# EAGLE design sc_v1 (EAGLE 9.6.2)
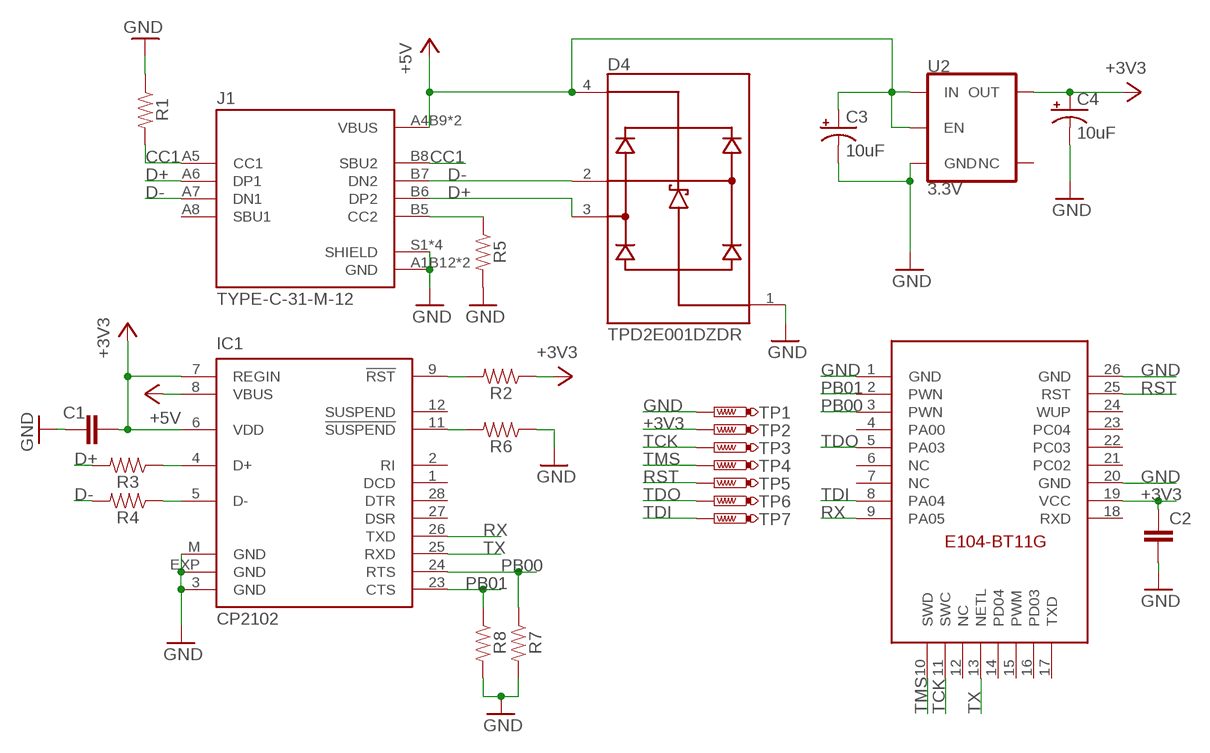
[diagram p0: schematic, sheet 1]

## Parts
C1  100nf  CAP0402  [CAPC1005X40N]
C2  100n  CAP0402  [CAPC1005X40N]
C3  10uF  10UF-POLAR-0603-6.3V-20%(TANT)  [0603-POLAR]
C4  10uF  10UF-POLAR-0603-6.3V-20%(TANT)  [0603-POLAR]
D4  TPD2E001DZDR  [SOT192P237X122-4N]
IC1  CP2102  [MLP28]
J1  TYPE-C-31-M-12  [HRO_TYPE-C-31-M-12]
R1  5.1k  RESISTOR0402  [0402]
R2  4.7k  RESISTOR0402  [0402]
R3  30Ohm  RESISTOR0402  [0402]
R4  30Ohm  RESISTOR0402  [0402]
R5  5.1k  RESISTOR0402  [0402]
R6  10k  RESISTOR0402  [0402]
R7  10k  RESISTOR0402  [0402]
R8  10k  RESISTOR0402  [0402]
TP1  PTR1TP10R  [TP10R]
TP2  PTR1TP10R  [TP10R]
TP3  PTR1TP10R  [TP10R]
TP4  PTR1TP10R  [TP10R]
TP5  PTR1TP10R  [TP10R]
TP6  PTR1TP10R  [TP10R]
TP7  PTR1TP10R  [TP10R]
U2  3.3V  V_REG_AP2112K-3.3V  [SOT23-5]
U$1  E104-BT11G-PCBPCB  [E104-BT11G-PCB]

## Nets
+3V3: C1.2 C2.1 C4.+ IC1.6(VDD) IC1.7(REGIN) R2.1 TP2.TP U2.5(OUT) U$1.19(VCC)
+5V: C3.+ D4.4(VCC) IC1.8(VBUS) J1.A4B9(VBUS) J1.B4A9(VBUS) U2.1(IN) U2.3(EN)
CC1: J1.A5(CC1) J1.B8(SBU2) R1.2
D+: D4.3(IO2) J1.A6(DP1) J1.B6(DP2) R3.2
D-: D4.2(IO1) J1.A7(DN1) J1.B7(DN2) R4.2
GND: C1.1 C2.2 C3.- C4.- D4.1(GND) IC1.3(GND) IC1.EXP(GND) IC1.M(GND) J1.A1B12(GND) J1.B1A12(GND) J1.S1(SHIELD) J1.S2(SHIELD) J1.S3(SHIELD) J1.S4(SHIELD) R1.1 R5.2 R6.1 R7.2 R8.2 TP1.TP U2.2(GND) U$1.1(GND) U$1.20(GND) U$1.26(GND)
N$1: IC1.4(D+) R3.1
N$2: IC1.5(D-) R4.1
N$3: IC1.9(!RST) R2.2
N$4: J1.B5(CC2) R5.1
N$5: IC1.11(!SUSPEND) R6.2
PB00: IC1.24(RTS) R7.1 U$1.3(PWN)
PB01: IC1.23(CTS) R8.1 U$1.2(PWN)
RST: TP5.TP U$1.25(RST)
RX: IC1.26(TXD) U$1.9(PA05)
TCK: TP3.TP U$1.11(SWC)
TDI: TP7.TP U$1.8(PA04)
TDO: TP6.TP U$1.5(PA03)
TMS: TP4.TP U$1.10(SWD)
TX: IC1.25(RXD) U$1.13(NETL)
Unconnected: IC1.1(DCD) IC1.2(RI) IC1.12(SUSPEND) IC1.27(DSR) IC1.28(DTR) J1.A8(SBU1) U2.4(NC) U$1.4(PA00) U$1.6(NC) U$1.7(NC) U$1.12(NC) U$1.14(PD04) U$1.15(PWM) U$1.16(PD03) U$1.17(TXD) U$1.18(RXD) U$1.21(PC02) U$1.22(PC03) U$1.23(PC04) U$1.24(WUP)

## Library data of the parts
C1 C2 = discretes-dev:CAP0402: CAP, 0402; AVAILABILITY: Good; DESCRIPTION: RESISTOR, 0402 0.063W 1% 3M6; Resistance:3.6Mohm; Resistance Tolerance:± 1%; Power Rating:0.063W; Voltage Rating:50V; Series:RC32H; Temperature Coefficient:± 100ppm/°C; Resistor Element Type:Thick Film; Resistor Case Style:0402; No. of Pins:2; SVHC:No SVHC; Case Style:0402; External Length / Height:1mm; Temperature Coeff. +:100ppm/°C; Temperature Coeff. -:100ppm/°C; External Depth:0.35mm; External Width:0.5mm; Operating Temperature Range:-55°C to +155°C; Overload Voltage:100V; MF: Yageo; MP: RC0402FR-073M6L; PACKAGE: 1005 Panasonic Electronic Components; PRICE: None; PURCHASE-URL: https://pricing.snapeda.com/search/part/RC0402FR-073M6L/?ref=eda
C3 C4 = SparkFun-Capacitors:10UF-POLAR: 10.0µF polarized capacitors A capacitor is a passive two-terminal electrical component used to store electrical energy temporarily in an electric field.; PROD_ID: CAP-13210
D4 = TPD2E001DZDR:TPD2E001DZDR: Low-capacitance 2-channel +/-15k-V ESD protection array for high-speed data interfaces Check prices <https://pricing.snapeda.com/parts/TPD2E001DZDR/Texas%20Instruments/view-part?ref=eda>; AVAILABILITY: In Stock; DESCRIPTION: Low-capacitance 2-channel +/-15k-V ESD protection array for high-speed data interfaces 4-SOT-23 -40 to 85; MF: Texas Instruments; MP: TPD2E001DZDR; PACKAGE: SOT-23-4 Texas Instruments; PRICE: None; PURCHASE-URL: https://pricing.snapeda.com/search/part/TPD2E001DZDR/?ref=eda
IC1 = silabs:CP210*: Single-Chip USB to UART Bridge Source: www.silabs.com .. CP2101.pdf / cp2102.pdf; MF: FARNELL; MPN: CP2102-GM; OC_FARNELL: 9282130; OC_NEWARK: 30K5635
J1 = TYPE-C-31-M-12:TYPE-C-31-M-12: USB Connectors 24 Receptacle 1 8.94*7.3mm RoHS; AVAILABILITY: Unavailable; DESCRIPTION: USB Connectors 24 Receptacle 1 8.94*7.3mm RoHS; MF: HRO Electronics Co., Ltd.; MP: TYPE-C-31-M-12; PACKAGE: Package; PRICE: None
R1-R8 = SparkFun-Resistors:RESISTOR: Generic Resistor Package
TP1-TP7 = testpad:PTR1: TEST PIN
U2 = SparkFun-IC-Power:V_REG_AP2112: AP2112 - 600mA CMOS LDO Regulator w/ Enable The AP2112 is CMOS process low dropout linear regulator with enable function, the regulator delivers a guaranteed 600mA (min.) continuous load current. Features Output Voltage Accuracy: ±1.5% Output Current: 600mA (Min.) Foldback Short Current Protection: 50mA Enable Function to Turn ON/OFF VOUT Low Dropout Voltage (3.3V): 250mV (Typ.) @IOUT=600mA Excellent Load Regulation: 0.2%/A (Typ.) Excellent Line Regulation: 0.02%/V (Typ.) Low Quiescent Current: 55μA (Typ.) Low Standby Current: 0.01μA (Typ.) Low Output Noise: 50μVRMS PSRR: 100Hz -65dB, 1kHz -65dB OTSD Protection Stable with 1.0μF Flexible Cap: Ceramic, Tantalum and Aluminum Electrolytic Operation Temperature Range: -40°C to 85°C ESD: MM 400V, HBM 4000V; PROD_ID: VREG-12457
U$1 = E104-BT11G-PCB:E104-BT11G-PCB

## Board
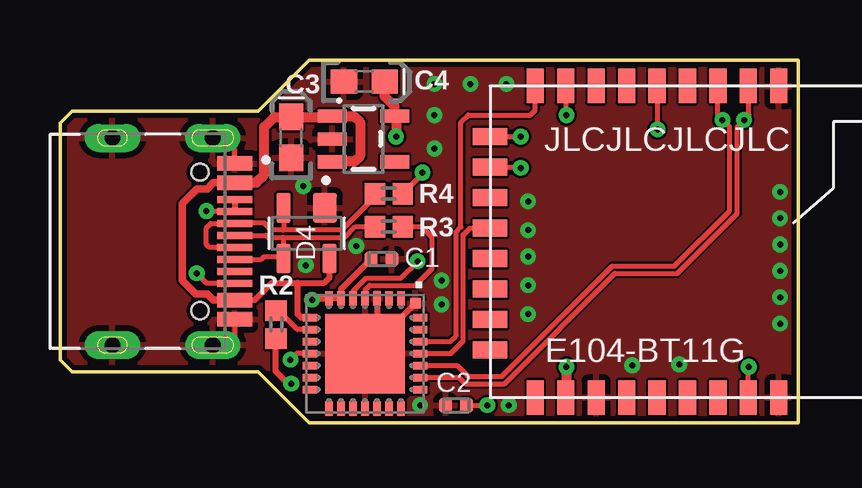
[diagram p1: board, top side]
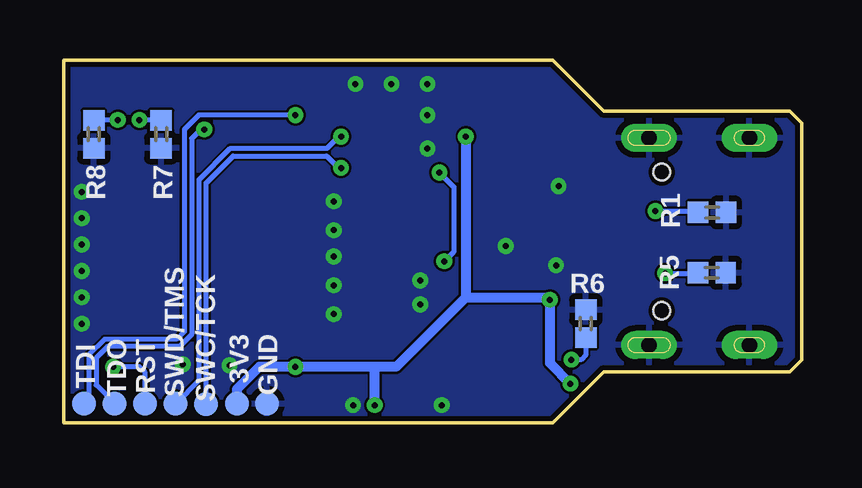
[diagram p2: board, bottom side, seen from below]

Size 30.75 x 15.12 mm. Coordinates in mm from the lower left corner, seen from the top.
Outline: 30.75,15.12 30.75,0 10.38,0 8.25,2.12 0.5,2.12 0,2.62 0,12.5 0.5,13 8.25,13 10.38,15.12 30.75,15.12
Copper layers (1*16): Top 0.035mm / dielectric 1.5mm / Bottom 0.035mm
Design rules "default": minimum track width 0.2mm, minimum drill 0.25mm, track to track 4mil, track to pad 4mil, pad to pad 4mil, via to via 4mil, smd to smd 4mil, copper to edge 0.2mm, drill to drill 0.25mm, minimum pad ring 10mil, minimum via ring 8mil, stop-mask expansion 2mil, vias tented up to drill 0.3mm, thermal gap 10mil

### Footprints (pad centres in the part's own frame; a part is rotated, then mirrored left to right if it is on the bottom)
CAPC1005X40N = smd 0.54 x 0.6: 1 -0.432,0; 2 0.432,0
0603-POLAR = smd 1.1 x 1: + 0.85,0; - -0.85,0
SOT192P237X122-4N = smd 1.24 x 0.99: 1 -1.055,0.76 | smd 1.24 x 0.59: 2 -1.055,-0.96; 3 1.055,-0.96; 4 1.055,0.96
MLP28 = smd 0.6 x 0.3: 1 -2.3,1.5; 2 -2.3,1; 3 -2.3,0.5; 4 -2.3,0; 5 -2.3,-0.5; 6 -2.3,-1; 7 -2.3,-1.5; 15 2.3,-1.5; 16 2.3,-1; 17 2.3,-0.5; 18 2.3,0; 19 2.3,0.5; 20 2.3,1; 21 2.3,1.5 | smd 0.3 x 0.6: 8 -1.5,-2.3; 9 -1,-2.3; 10 -0.5,-2.3; 11 0,-2.3; 12 0.5,-2.3; 13 1,-2.3; 14 1.5,-2.3; 22 1.5,2.3; 23 1,2.3; 24 0.5,2.3; 25 0,2.3; 26 -0.5,2.3; 27 -1,2.3; 28 -1.5,2.3 | smd 3.3 x 3.3: EXP 0,0 | smd 0.435 x 0.435: M -2.103,2.103
HRO_TYPE-C-31-M-12 = smd 0.6 x 1.45: A1B12 -3.25,5.095; A4B9 -2.45,5.095; B1A12 3.25,5.095; B4A9 2.45,5.095 | smd 0.3 x 1.45: A5 -1.25,5.095; A6 -0.25,5.095; A7 0.25,5.095; A8 1.25,5.095; B5 1.75,5.095; B6 0.75,5.095; B7 -0.75,5.095; B8 -1.75,5.095 | drill 0.65 pad 1.05 long: S1 -4.32,4.18; S2 4.32,4.18; S3 -4.32,0; S4 4.32,0 | hole 0.7: -2.89,3.65; 2.89,3.65
0402 = smd 0.85 x 0.9: 1 -0.58,0; 2 0.58,0
TP10R = smd 1 x 1: TP 0,0
SOT23-5 = smd 0.55 x 1.2: 1 -0.95,-1.3; 2 0,-1.3; 3 0.95,-1.3; 4 0.95,1.3; 5 -0.95,1.3
E104-BT11G-PCB = smd 1.422 x 0.711: 1 -0.043,12.039; 2 -0.043,10.769; 3 -0.043,9.499; 4 -0.043,8.229; 5 -0.043,6.959; 6 -0.043,5.689; 7 -0.043,4.419; 8 -0.043,3.149; 9 -0.043,1.879; 18 12.954,1.879; 19 12.954,3.149; 20 12.954,4.419; 21 12.954,5.689; 22 12.954,6.959; 23 12.954,8.229; 24 12.954,9.499; 25 12.954,10.769; 26 12.954,12.039 | smd 0.711 x 1.422: 10 2.079,0; 11 3.349,0; 12 4.619,0; 13 5.889,0; 14 7.159,0; 15 8.429,0; 16 9.699,0; 17 10.969,0

### Placement (x,y rotation side)
C1  13.4,6.83 180 top
C2  16.5,0.72 180 top
C3  9.63,11.89 90 top
C4  12.68,14.22 0 top
D4  10.28,7.9 270 top
IC1  12.71,2.88 270 top
J1  2.19,7.55 270 top
R1  3.74,8.76 180 bottom
R2  9.01,4.09 90 top
R3  13.7,8.18 180 top
R4  13.7,9.55 180 top
R5  3.75,6.25 0 bottom
R6  9,4.12 270 bottom
R7  26.7,12.03 270 bottom
R8  29.5,12.03 270 bottom
TP1  22.29,0.79 0 bottom
TP2  23.54,0.79 0 bottom
TP3  24.82,0.78 0 bottom
TP4  26.09,0.79 0 bottom
TP5  27.36,0.8 0 bottom
TP6  28.63,0.79 0 bottom
TP7  29.91,0.79 0 bottom
U2  12.65,11.83 270 top
U$1  17.92,14 270 top

### Tracks (layer width: path | path; a pad name or v marks a point on that pad's centre or on a via)
+3V3  (via drill 0.25)
  Top 0.2: C2.1 v17.8,0.72
  Top 0.254: v10.5,5.12 10.55,5.17 IC1.7 IC1.6 11.71,5.57 C1.2 | R2.1 8.97,3.47 8.97,2.15 9.5,1.62 v9.64,1.62
  Top 0.406: C4.+ 13.53,13.59 13.95,13.18 U2.5 14,12.72 v14,11.93 | v21.1,2.33 21.1,1.08 U$1.19
  Bottom 0.406: v14,11.93 14,5.22 | 17.9,2.33 16.9,2.33 14,5.22 | 17.9,2.33 v21.1,2.33 22.6,2.33 23.54,1.39 TP2.TP | 14,5.22 10.6,5.22 v10.5,5.12 10.5,2.48 v9.64,1.62 | v17.8,0.72 17.8,2.23 17.9,2.33
+5V
  Top 0.254: J1.B4A9 8.11,5.11 8.83,5.83 9.9,5.83 | IC1.8 10.05,4.38 9.9,4.53 9.9,5.83 | 9.9,5.83 11,5.83 11.23,6.06 D4.4
  Top 0.305: J1.B4A9 6.39,5.11 6.13,5.37 5.66,5.37 5.1,5.92 5.1,9.14 5.7,9.74 6.13,9.74 6.39,10.01 J1.A4B9
  Top 0.406: J1.A4B9 8.18,10.01 8.5,10.32 8.5,12.32 8.92,12.74 C3.+ 11.31,12.74 U2.1 12.25,12.78 12.5,12.53 12.5,11.12 12.25,10.88 U2.3
CC1  (via drill 0.25)
  Top 0.2: J1.A5 6.12,8.8 v6.1,8.82
  Top 0.254: J1.B8 J1.A5
  Bottom 0.2: R1.2 4.38,8.82 v6.1,8.82
D+
  Top 0.2: D4.3 9.28,6.8 9.23,6.85 | R3.2 12.31,8.18 11.86,7.72 9.3,7.72 | J1.B6 8.38,6.8 8.5,6.93 9.15,6.93 9.23,6.85 | J1.A6 8.59,7.8 8.68,7.72 9.3,7.72 | 9.3,7.72 9.3,6.92 9.23,6.85
D-
  Top 0.2: J1.A7 6.22,7.3 6.1,7.42 6.1,8.12 6.28,8.3 J1.B7 7.3,8.32 8.5,8.32 8.8,8.03 9.3,8.03 | R4.2 13.16,9.51 13.22,9.51 11.73,8.03 9.3,8.03 | D4.2 9.31,8.04 9.3,8.03
GND  (via drill 0.25)
  Top 0.2: J1.A1B12 7.28,11.36 6.76,11.88 J1.S1 | J1.B1A12 7.28,3.6 6.91,3.23 J1.S2
  Top 0.254: IC1.3 13.21,3.83 | 13.21,3.83 13.21,3.38 IC1.EXP | IC1.M 13.66,3.83 13.21,3.83
  other vias: 12.34,7.36 15.9,5.92 19.5,4.53 19.5,5.72 19.5,6.92 30,9.62 30,8.53 30,7.42 30,6.33 30,5.22 30,4.12 19.5,8.03 19.5,9.22 15.6,11.43 15.6,12.82 15.9,4.92 25.8,2.42 15.6,14.12 10.14,9.86 23.84,2.39 18.7,0.72 15,0.72 17.1,14.12 18.6,14.12 10.24,6.56
  pour Top: -0.18,-0.33 30.89,-0.33 30.89,15.2 -0.18,15.2
  pour Bottom: -0.5,-0.17 31.09,-0.17 31.09,15.31 -0.5,15.31
N$1
  Top 0.2: R3.1 15.05,8.18 15.5,7.72 15.5,6.42 14.8,5.72 12.9,5.72 12.71,5.54 IC1.4
N$2  (via drill 0.25)
  Top 0.2: v14.9,6.72 14.2,6.03 12.75,6.03 12.21,5.49 IC1.5 | R4.1 15.1,10.37 v15.1,10.43
  Bottom 0.2: v15.1,10.43 14.5,9.82 14.5,7.12 v14.9,6.72
N$3
  Top 0.2: IC1.9 9.89,3.88 9.1,4.67 R2.2
N$4  (via drill 0.25)
  Top 0.2: J1.B5 6.12,5.8 v5.7,6.22
  Bottom 0.2: v5.7,6.22 4.36,6.22 R5.1
N$5  (via drill 0.25)
  Top 0.2: IC1.11 9.85,2.88 v9.6,2.62
  Bottom 0.2: R6.2 9,2.83 9.2,2.62 v9.6,2.62
PB00  (via drill 0.25)
  Top 0.2: IC1.24 16.55,2.38 17,1.93 18.4,1.93 23,6.53 25.6,6.53 27.9,8.82 27.9,12.32 v27.6,12.62 27.4,12.82 27.4,14.03 U$1.3
  Bottom 0.2: R7.1 26.72,12.62 v27.6,12.62
PB01  (via drill 0.25)
  Top 0.2: IC1.23 16.62,1.88 16.88,1.62 18.52,1.62 23.12,6.22 25.73,6.22 28.22,8.72 28.22,12.34 v28.5,12.62 28.7,12.82 28.7,14.03 U$1.2
  Bottom 0.2: v28.5,12.62 29.48,12.62 R8.1
RST  (via drill 0.25)
  Top 0.2: U$1.25 28.69,2.31 v28.7,2.33
  Bottom 0.2: TP5.TP 27.36,2.09 27.6,2.33 v28.7,2.33
RX
  Top 0.2: IC1.26 16.25,3.38 16.5,3.62 16.5,7.95 16.7,8.15 16.7,12.53 17,12.82 19.6,12.82 19.8,13.02 U$1.9
TCK  (via drill 0.25)
  Top 0.2: U$1.11 19.18,10.65 v19.2,10.62
  Bottom 0.2: TP3.TP 24.82,10 23.7,11.12 19.8,11.12 19.3,10.62 v19.2,10.62
TDI  (via drill 0.25)
  Top 0.2: U$1.8 21.07,12.86 v21.1,12.82
  Bottom 0.2: TP7.TP 29.71,0.99 29.71,2.81 29.05,3.48 26.05,3.48 25.73,3.79 25.73,12.22 25.13,12.82 v21.1,12.82
TDO  (via drill 0.25)
  Top 0.2: U$1.5 24.88,12.22 v24.9,12.22
  Bottom 0.2: v24.9,12.22 25.05,12.22 25.43,11.85 25.43,3.67 25.93,3.17 28.93,3.17 29.41,2.69 29.41,1.57 TP6.TP
TMS  (via drill 0.25)
  Top 0.2: U$1.10 v19.19,11.92 v19.2,11.93
  Bottom 0.2: v19.2,11.93 19.3,11.93 19.78,11.44 23.81,11.44 25.13,10.12 25.13,1.76 TP4.TP
TX
  Top 0.2: U$1.13 17.09,8.11 16.8,7.82 16.8,3.4 16.28,2.88 IC1.25

### Text on the board
tNames: C3 | C4 | JLCJLCJLCJLC | . | E104-BT11G
bNames: SWC/TCK | SWD/TMS | GND | 3V3 | RST | TDO | TDI